# Altium schematic sheet Master Schematic.SchDoc
size A
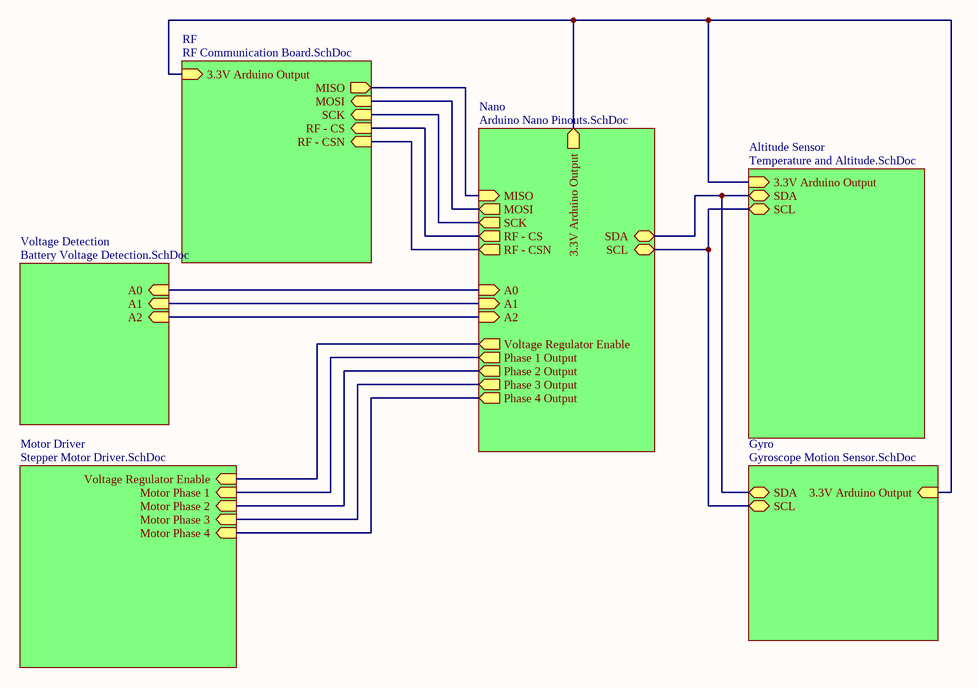
[diagram p0: Master Schematic.SchDoc]

## Sub-sheets
Altitude Sensor = Temperature and Altitude.SchDoc: 3.3V Arduino Output (in), SDA (bidir), SCL (bidir)
Gyro = Gyroscope Motion Sensor.SchDoc: 3.3V Arduino Output (in), SDA (bidir), SCL (bidir)
Motor Driver = Stepper Motor Driver.SchDoc: Voltage Regulator Enable (in), Motor Phase 1 (in), Motor Phase 2 (in), Motor Phase 3 (in), Motor Phase 4 (in)
Nano = Arduino Nano Pinouts.SchDoc: MISO (in), MOSI (out), SCK (out), RF - CS (out), 3.3V Arduino Output (out), A0 (in), A1 (in), A2 (in), SDA (bidir), SCL (bidir), Phase 1 Output (out), Voltage Regulator Enable (out), Phase 2 Output (out), Phase 3 Output (out), Phase 4 Output (out), RF - CSN (out)
RF = RF Communication Board.SchDoc: MISO (out), SCK (in), MOSI (in), 3.3V Arduino Output (in), RF - CS (in), RF - CSN (in)
Voltage Detection = Battery Voltage Detection.SchDoc: A0 (in), A1 (in), A2 (in)

## Nets
(unnamed): sheet Nano/MISO, sheet RF/MISO
(unnamed): sheet Nano/MOSI, sheet RF/MOSI
(unnamed): sheet Nano/SCK, sheet RF/SCK
(unnamed): sheet Nano/RF - CS, sheet RF/RF - CS
(unnamed): sheet Nano/3.3V Arduino Output, sheet Gyro/3.3V Arduino Output, sheet RF/3.3V Arduino Output, sheet Altitude Sensor/3.3V Arduino Output
(unnamed): sheet Nano/A0, sheet Voltage Detection/A0
(unnamed): sheet Nano/A1, sheet Voltage Detection/A1
(unnamed): sheet Nano/A2, sheet Voltage Detection/A2
(unnamed): sheet Nano/SDA, sheet Gyro/SDA, sheet Altitude Sensor/SDA
(unnamed): sheet Nano/SCL, sheet Gyro/SCL, sheet Altitude Sensor/SCL
(unnamed): sheet Nano/Phase 1 Output, sheet Motor Driver/Motor Phase 1
(unnamed): sheet Nano/Voltage Regulator Enable, sheet Motor Driver/Voltage Regulator Enable
(unnamed): sheet Nano/Phase 2 Output, sheet Motor Driver/Motor Phase 2
(unnamed): sheet Nano/Phase 3 Output, sheet Motor Driver/Motor Phase 3
(unnamed): sheet Nano/Phase 4 Output, sheet Motor Driver/Motor Phase 4
(unnamed): sheet Nano/RF - CSN, sheet RF/RF - CSN